# EasyEDA schematic SCH_LightsGames_2023-01-02.json
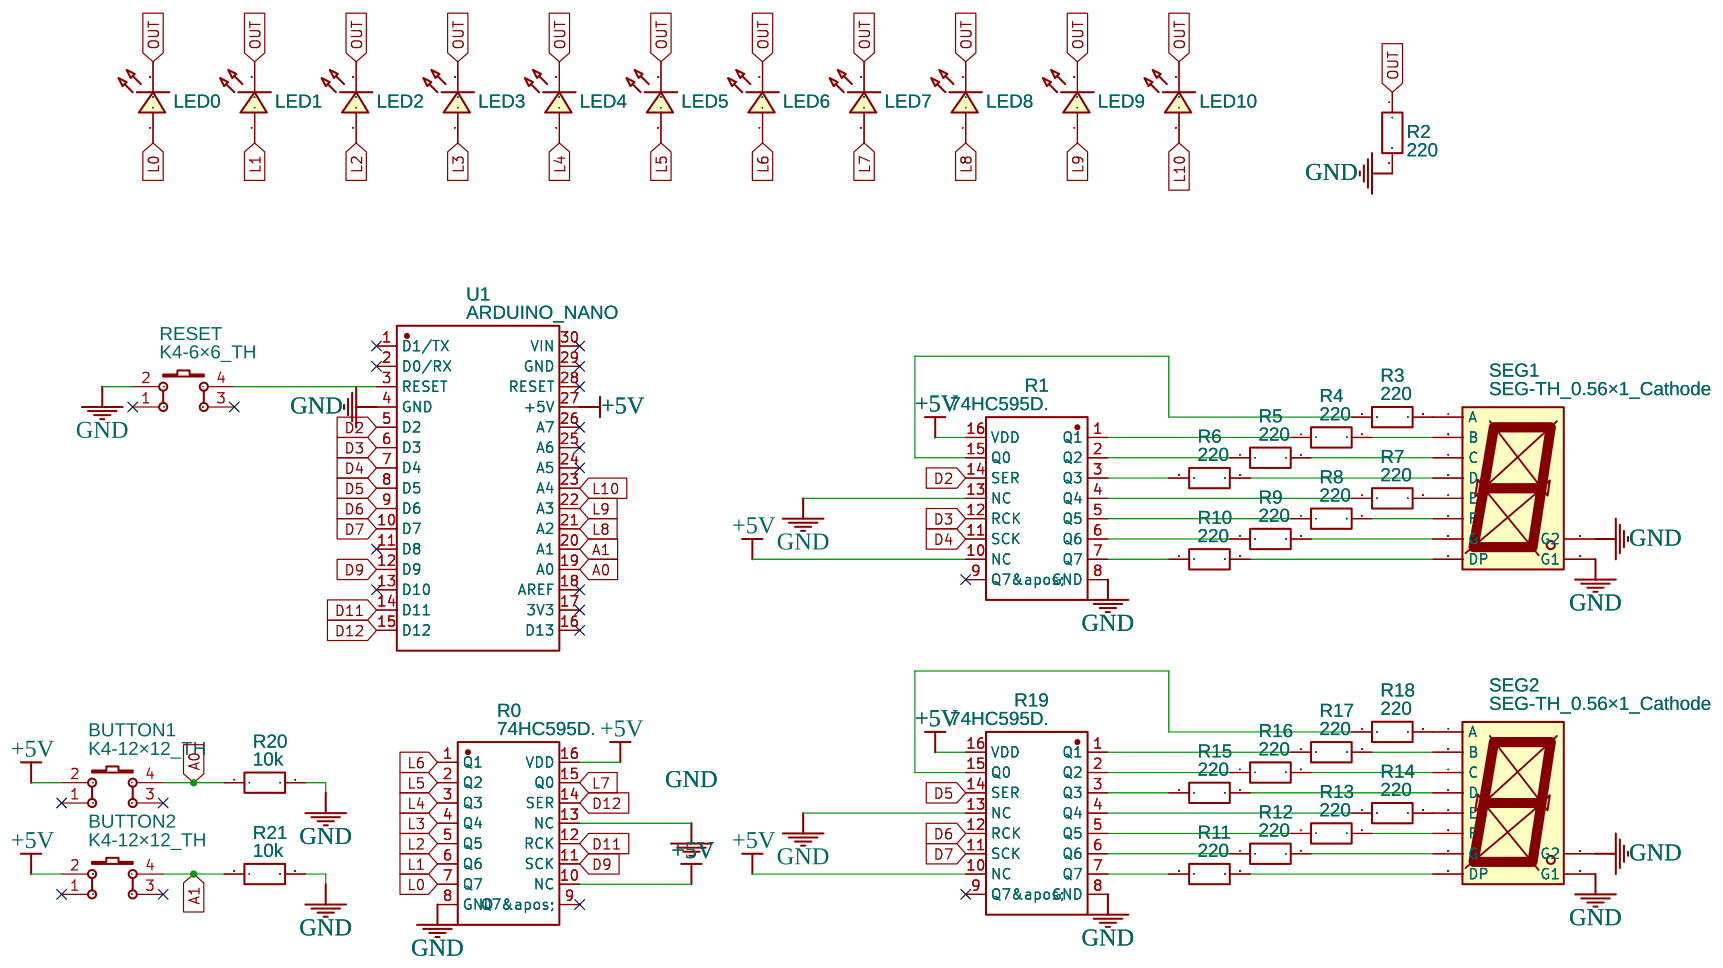
[diagram p0: schematic sheet]

## Parts
BUTTON1  K4-12×12_TH  [KEY-TH_4P-L12.0-W12.0-P5.00-LS12.5]
BUTTON2  K4-12×12_TH  [KEY-TH_4P-L12.0-W12.0-P5.00-LS12.5]
LED0  LED-TH-5mm_R  [LED-TH_BD5.0_RED]
LED1  LED-TH-5mm_R  [LED-TH_BD5.0_RED]
LED2  LED-TH-5mm_R  [LED-TH_BD5.0_RED]
LED3  LED-TH-5mm_G  [LED-TH_BD5.0_GREEN]
LED4  LED-TH-5mm_G  [LED-TH_BD5.0_GREEN]
LED5  LED-TH-5mm_G  [LED-TH_BD5.0_GREEN]
LED6  LED-TH-5mm_G  [LED-TH_BD5.0_GREEN]
LED7  LED-TH-5mm_G  [LED-TH_BD5.0_GREEN]
LED8  LED-TH-5mm_R  [LED-TH_BD5.0_RED]
LED9  LED-TH-5mm_R  [LED-TH_BD5.0_RED]
LED10  LED-TH-5mm_R  [LED-TH_BD5.0_RED]
R0  74HC595D.  [SOP-16_L9.9-W3.9-P1.27-LS6.0-BL]
R1  74HC595D.  [SOP-16_L9.9-W3.9-P1.27-LS6.0-BL]
R2  220  [R0603]
R3  220  [R0603]
R4  220  [R0603]
R5  220  [R0603]
R6  220  [R0603]
R7  220  [R0603]
R8  220  [R0603]
R9  220  [R0603]
R10  220  [R0603]
R11  220  [R0603]
R12  220  [R0603]
R13  220  [R0603]
R14  220  [R0603]
R15  220  [R0603]
R16  220  [R0603]
R17  220  [R0603]
R18  220  [R0603]
R19  74HC595D.  [SOP-16_L9.9-W3.9-P1.27-LS6.0-BL]
R20  10k  [R0603]
R21  10k  [R0603]
RESET  K4-6×6_TH  [KEY-TH_4P-L6.0-W6.0-P4.50-LS6.5]
SEG1  SEG-TH_0.56×1_Cathode  [LED-SEG-TH_10P-L12.6-W19.0-P2.54-S15.24-BL]
SEG2  SEG-TH_0.56×1_Cathode  [LED-SEG-TH_10P-L12.6-W19.0-P2.54-S15.24-BL]
U1  ARDUINO_NANO  [COMM-TH_ARDUINO_NANO]

## Library data of the parts
BUTTON1 BUTTON2 = K4-12×12_TH: Supplier Part: C128053; Supplier: LCSC; Manufacturer: 韩国韩荣; Manufacturer Part: K2-1103DP-M4SW-04; Contributor: LCEDA_Lib
LED0-LED2 LED8-LED10 = LED-TH-5mm_R: Manufacturer: EVERLIGHT(台湾亿光); Manufacturer Part: 333-2SURD/S530-A3; Supplier Part: C87271; Supplier: LCSC; Contributor: LCEDA_Lib
LED3-LED7 = LED-TH-5mm_G: Manufacturer: EVERLIGHT(台湾亿光); Manufacturer Part: 333-2SYGD/S530-E2; Supplier Part: C88163; Supplier: LCSC; Contributor: LCEDA_Lib
R0 R1 R19 = 74HC595D.: Supplier: LCSC; Supplier Part: C2929943; Manufacturer: FM富满; Contributor: LCSC; JLCPCB Part Class: Extended Part
R2-R18 R20 R21 = R_0603_EU: Contributor: LCEDA_Lib
RESET = K4-6×6_TH: Supplier: LCSC; Supplier Part: C136684; Manufacturer: 韩国韩荣; Manufacturer Part: K2-1102DP-E4SW-04; Contributor: LCEDA_Lib
SEG1 SEG2 = SEG-TH_0.56×1_Cathode: Manufacturer: 志浩; Supplier Part: C8093; Contributor: LCEDA_01
U1 = ARDUINO_NANO: Supplier: LCSC; Supplier Part: C9900017879; Manufacturer: null; JLCPCB Part Class: Extended Part; Contributor: lcsc

## Nets
+5V: BUTTON1.2 BUTTON2.2 R0.10(NC) R0.16(VDD) R1.10(NC) R1.16(VDD) R19.10(NC) R19.16(VDD) U1.27(+5V)
GND: R0.8(GND) R0.13(NC) R1.8(GND) R1.13(NC) R2.2 R19.8(GND) R19.13(NC) R20.2 R21.2 RESET.2 SEG1.3(G1) SEG1.8(G2) SEG2.3(G1) SEG2.8(G2) U1.4(GND)
A0: BUTTON1.4 R20.1 U1.19(A0)
A1: BUTTON2.4 R21.1 U1.20(A1)
D2: R1.14(SER) U1.5(D2)
D3: R1.12(RCK) U1.6(D3)
D4: R1.11(SCK) U1.7(D4)
D5: R19.14(SER) U1.8(D5)
D6: R19.12(RCK) U1.9(D6)
D7: R19.11(SCK) U1.10(D7)
D9: R0.11(SCK) U1.12(D9)
D11: R0.12(RCK) U1.14(D11)
D12: R0.14(SER) U1.15(D12)
L0: LED0.1 R0.7(Q7)
L1: LED1.1 R0.6(Q6)
L2: LED2.1 R0.5(Q5)
L3: LED3.1 R0.4(Q4)
L4: LED4.1 R0.3(Q3)
L5: LED5.1 R0.2(Q2)
L6: LED6.1 R0.1(Q1)
L7: LED7.1 R0.15(Q0)
L8: LED8.1 U1.21(A2)
L9: LED9.1 U1.22(A3)
L10: LED10.1 U1.23(A4)
OUT: LED0.2 LED1.2 LED2.2 LED3.2 LED4.2 LED5.2 LED6.2 LED7.2 LED8.2 LED9.2 LED10.2 R2.1
Net-(R1-1): R1.1(Q1) R4.1
Net-(R1-2): R1.2(Q2) R5.1
Net-(R1-3): R1.3(Q3) R6.1
Net-(R1-4): R1.4(Q4) R7.1
Net-(R1-5): R1.5(Q5) R8.1
Net-(R1-6): R1.6(Q6) R9.1
Net-(R1-7): R1.7(Q7) R10.1
Net-(R1-15): R1.15(Q0) R3.1
Net-(R3-2): R3.2 SEG1.7(A)
Net-(R4-2): R4.2 SEG1.6(B)
Net-(R5-2): R5.2 SEG1.4(C)
Net-(R6-2): R6.2 SEG1.2(D)
Net-(R7-2): R7.2 SEG1.1(E)
Net-(R8-2): R8.2 SEG1.9(F)
Net-(R9-2): R9.2 SEG1.10(G)
Net-(R10-2): R10.2 SEG1.5(DP)
Net-(R11-1): R11.1 R19.7(Q7)
Net-(R11-2): R11.2 SEG2.5(DP)
Net-(R12-1): R12.1 R19.6(Q6)
Net-(R12-2): R12.2 SEG2.10(G)
Net-(R13-1): R13.1 R19.5(Q5)
Net-(R13-2): R13.2 SEG2.9(F)
Net-(R14-1): R14.1 R19.4(Q4)
Net-(R14-2): R14.2 SEG2.1(E)
Net-(R15-1): R15.1 R19.3(Q3)
Net-(R15-2): R15.2 SEG2.2(D)
Net-(R16-1): R16.1 R19.2(Q2)
Net-(R16-2): R16.2 SEG2.4(C)
Net-(R17-1): R17.1 R19.1(Q1)
Net-(R17-2): R17.2 SEG2.6(B)
Net-(R18-1): R18.1 R19.15(Q0)
Net-(R18-2): R18.2 SEG2.7(A)
Net-(RESET-4): RESET.4 U1.3(RESET)

Not connected (* = marked no-connect by the designer): BUTTON1 1* 3*; BUTTON2 1* 3*; R0 9(Q7')*; R1 9(Q7')*; R19 9(Q7')*; RESET 1* 3*; U1 1(D1/TX)* 2(D0/RX)* 11(D8)* 13(D10)* 16(D13)* 17(3V3)* 18(AREF)* 24(A5)* 25(A6)* 26(A7)* 28(RESET)* 29(GND)* 30(VIN)*
